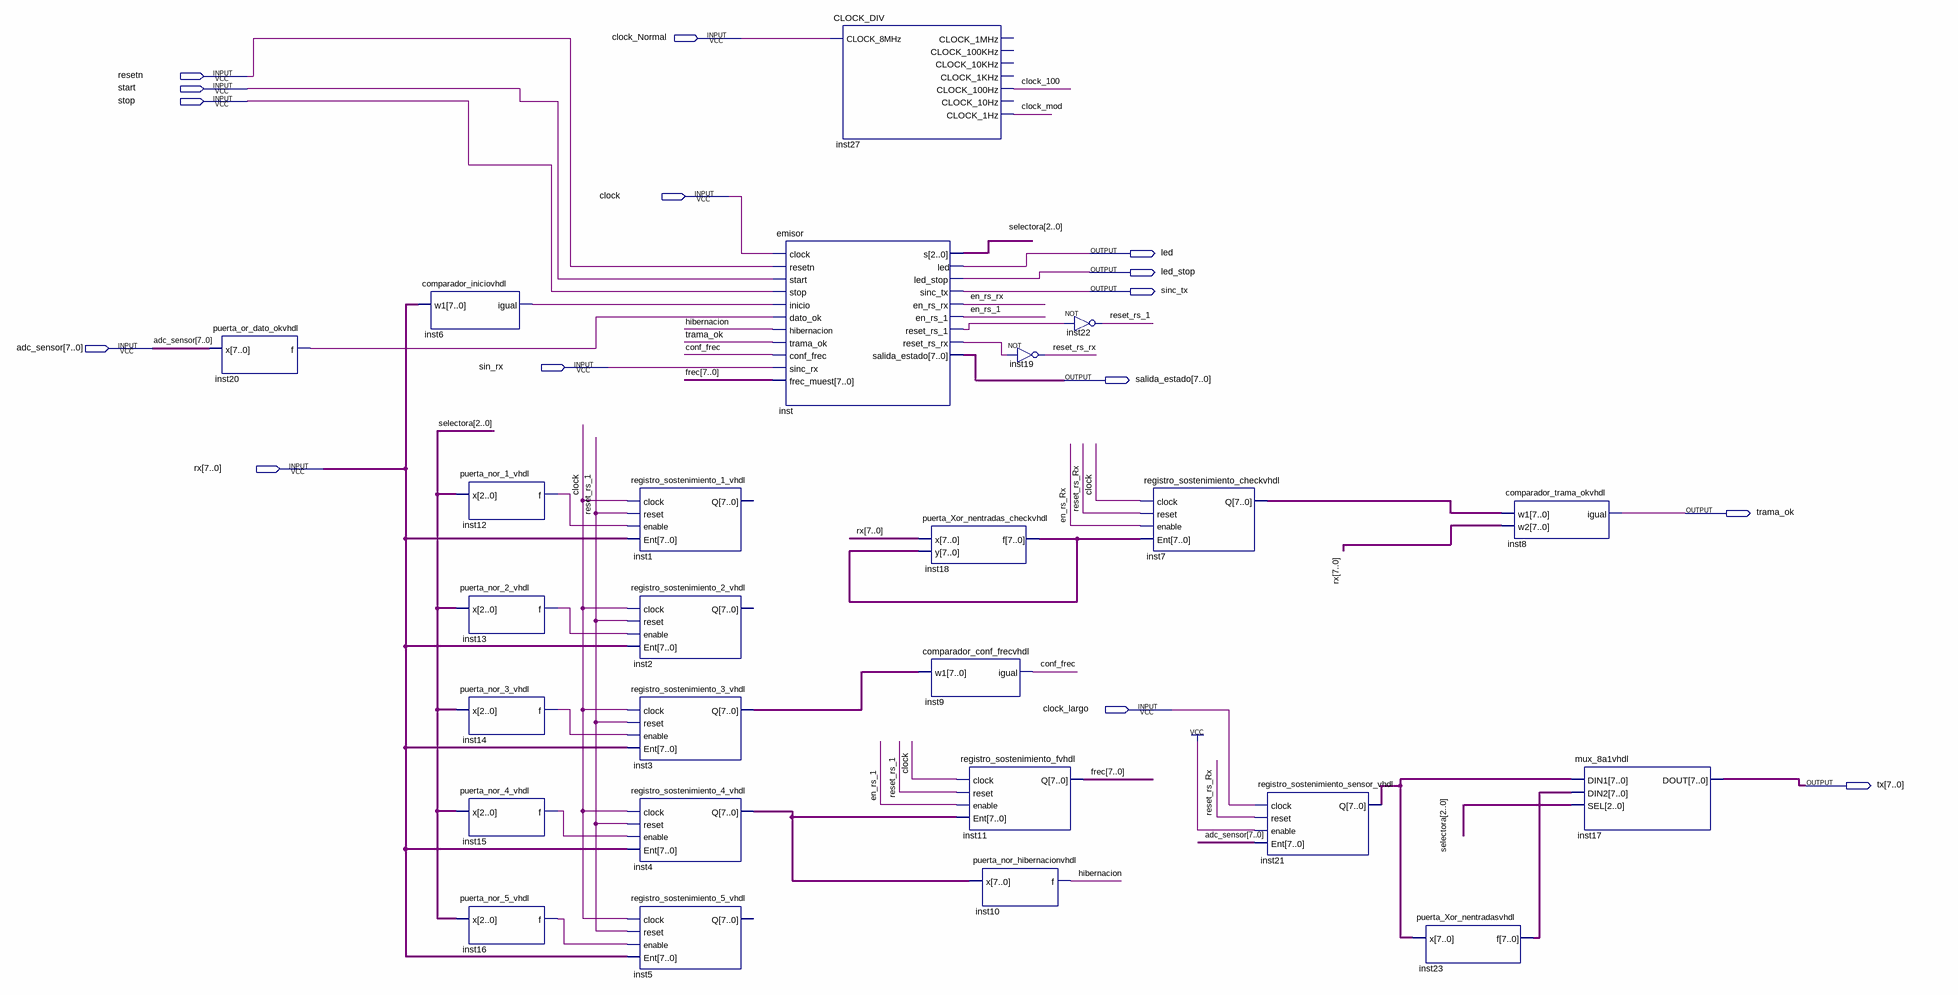
[diagram p0: schematic sheet]
// Quartus schematic Block1.bdf as structural Verilog: 25 symbols, 15 pins
module Block1 (
  input  clock_Normal,
  input  resetn,
  input  start,
  input  stop,
  input  clock,
  input  [7:0] adc_sensor,
  input  sin_rx,
  input  [7:0] rx,
  input  clock_largo,
  output led,
  output led_stop,
  output sinc_tx,
  output [7:0] salida_estado,
  output trama_ok,
  output [7:0] tx
);

  wire clock_100, clock_mod, conf_frec, en_rs_1, en_rs_Rx, hibernacion, inst6_igual, inst12_f, inst13_f,
       inst14_f, inst15_f, inst16_f, inst20_f, inst_reset_rs_1, inst_reset_rs_rx, reset_rs_1, reset_rs_Rx;
  wire [2:0] selectora;
  wire [7:0] frec, inst3_q, inst4_q, inst7_q, inst18_f, inst21_q, inst23_f;

  puerta_or_dato_okvhdl inst20 (.x(adc_sensor), .f(inst20_f));
  comparador_iniciovhdl inst6 (.w1(rx), .igual(inst6_igual));
  puerta_nor_1_vhdl inst12 (.x(selectora), .f(inst12_f));
  puerta_nor_2_vhdl inst13 (.x(selectora), .f(inst13_f));
  puerta_nor_3_vhdl inst14 (.x(selectora), .f(inst14_f));
  puerta_nor_4_vhdl inst15 (.x(selectora), .f(inst15_f));
  puerta_nor_5_vhdl inst16 (.x(selectora), .f(inst16_f));
  registro_sostenimiento_1_vhdl inst1 (.clock(clock), .reset(reset_rs_1), .enable(inst12_f), .Ent(rx));  // open: Q
  registro_sostenimiento_2_vhdl inst2 (.clock(clock), .reset(reset_rs_1), .enable(inst13_f), .Ent(rx));  // open: Q
  registro_sostenimiento_3_vhdl inst3 (.clock(clock), .reset(reset_rs_1), .enable(inst14_f), .Ent(rx), .Q(inst3_q));
  registro_sostenimiento_4_vhdl inst4 (.clock(clock), .reset(reset_rs_1), .enable(inst15_f), .Ent(rx), .Q(inst4_q));
  registro_sostenimiento_5_vhdl inst5 (.clock(clock), .reset(reset_rs_1), .enable(inst16_f), .Ent(rx));  // open: Q
  emisor inst (
    .clock(clock), .resetn(resetn), .start(start), .stop(stop), .inicio(inst6_igual), .dato_ok(inst20_f),
    .hibernacion(hibernacion), .trama_ok(trama_ok), .conf_frec(conf_frec), .sinc_rx(sin_rx),
    .frec_muest(frec), .s(selectora), .led(led), .led_stop(led_stop), .sinc_tx(sinc_tx), .en_rs_rx(en_rs_Rx),
    .en_rs_1(en_rs_1), .reset_rs_1(inst_reset_rs_1), .reset_rs_rx(inst_reset_rs_rx),
    .salida_estado(salida_estado));
  CLOCK_DIV inst27 (
    .CLOCK_8MHz(clock_Normal), .CLOCK_100Hz(clock_100), .CLOCK_1Hz(clock_mod));  // open: CLOCK_1MHz, CLOCK_100KHz, CLOCK_10KHz, CLOCK_1KHz, CLOCK_10Hz
  puerta_Xor_nentradas_checkvhdl inst18 (.x(rx), .y(inst18_f), .f(inst18_f));
  comparador_conf_frecvhdl inst9 (.w1(inst3_q), .igual(conf_frec));
  registro_sostenimiento_fvhdl inst11 (.clock(clock), .reset(reset_rs_1), .enable(en_rs_1), .Ent(inst4_q), .Q(frec));
  puerta_nor_hibernacionvhdl inst10 (.x(inst4_q), .f(hibernacion));
  not inst19 (reset_rs_Rx, inst_reset_rs_rx);
  not inst22 (reset_rs_1, inst_reset_rs_1);
  registro_sostenimiento_checkvhdl inst7 (
    .clock(clock), .reset(reset_rs_Rx), .enable(en_rs_Rx), .Ent(inst18_f), .Q(inst7_q));
  registro_sostenimiento_sensor_vhdl inst21 (
    .clock(clock_largo), .reset(reset_rs_Rx), .enable(1'b1), .Ent(adc_sensor), .Q(inst21_q));
  puerta_Xor_nentradasvhdl inst23 (.x(inst21_q), .f(inst23_f));
  comparador_trama_okvhdl inst8 (.w1(inst7_q), .w2(rx), .igual(trama_ok));
  mux_8a1vhdl inst17 (.DIN1(inst21_q), .DIN2(inst23_f), .SEL(selectora), .DOUT(tx));
endmodule
